# Altium schematic sheet Axis_Channel.SchDoc: Axis Channel
size A3; Organization: ORGANIZATION; Address1: ADDRESS 1; Address2: ADDRESS 2; Address3: ADDRESS 3; Address4: ADDRESS 4; Revision: 1.0; SheetNumber: 4; SheetTotal: 4; ENG_APP_DATE: --/--/--; DSN_APP_DATE: --/--/--; CHK_APP_DATE: --/--/--
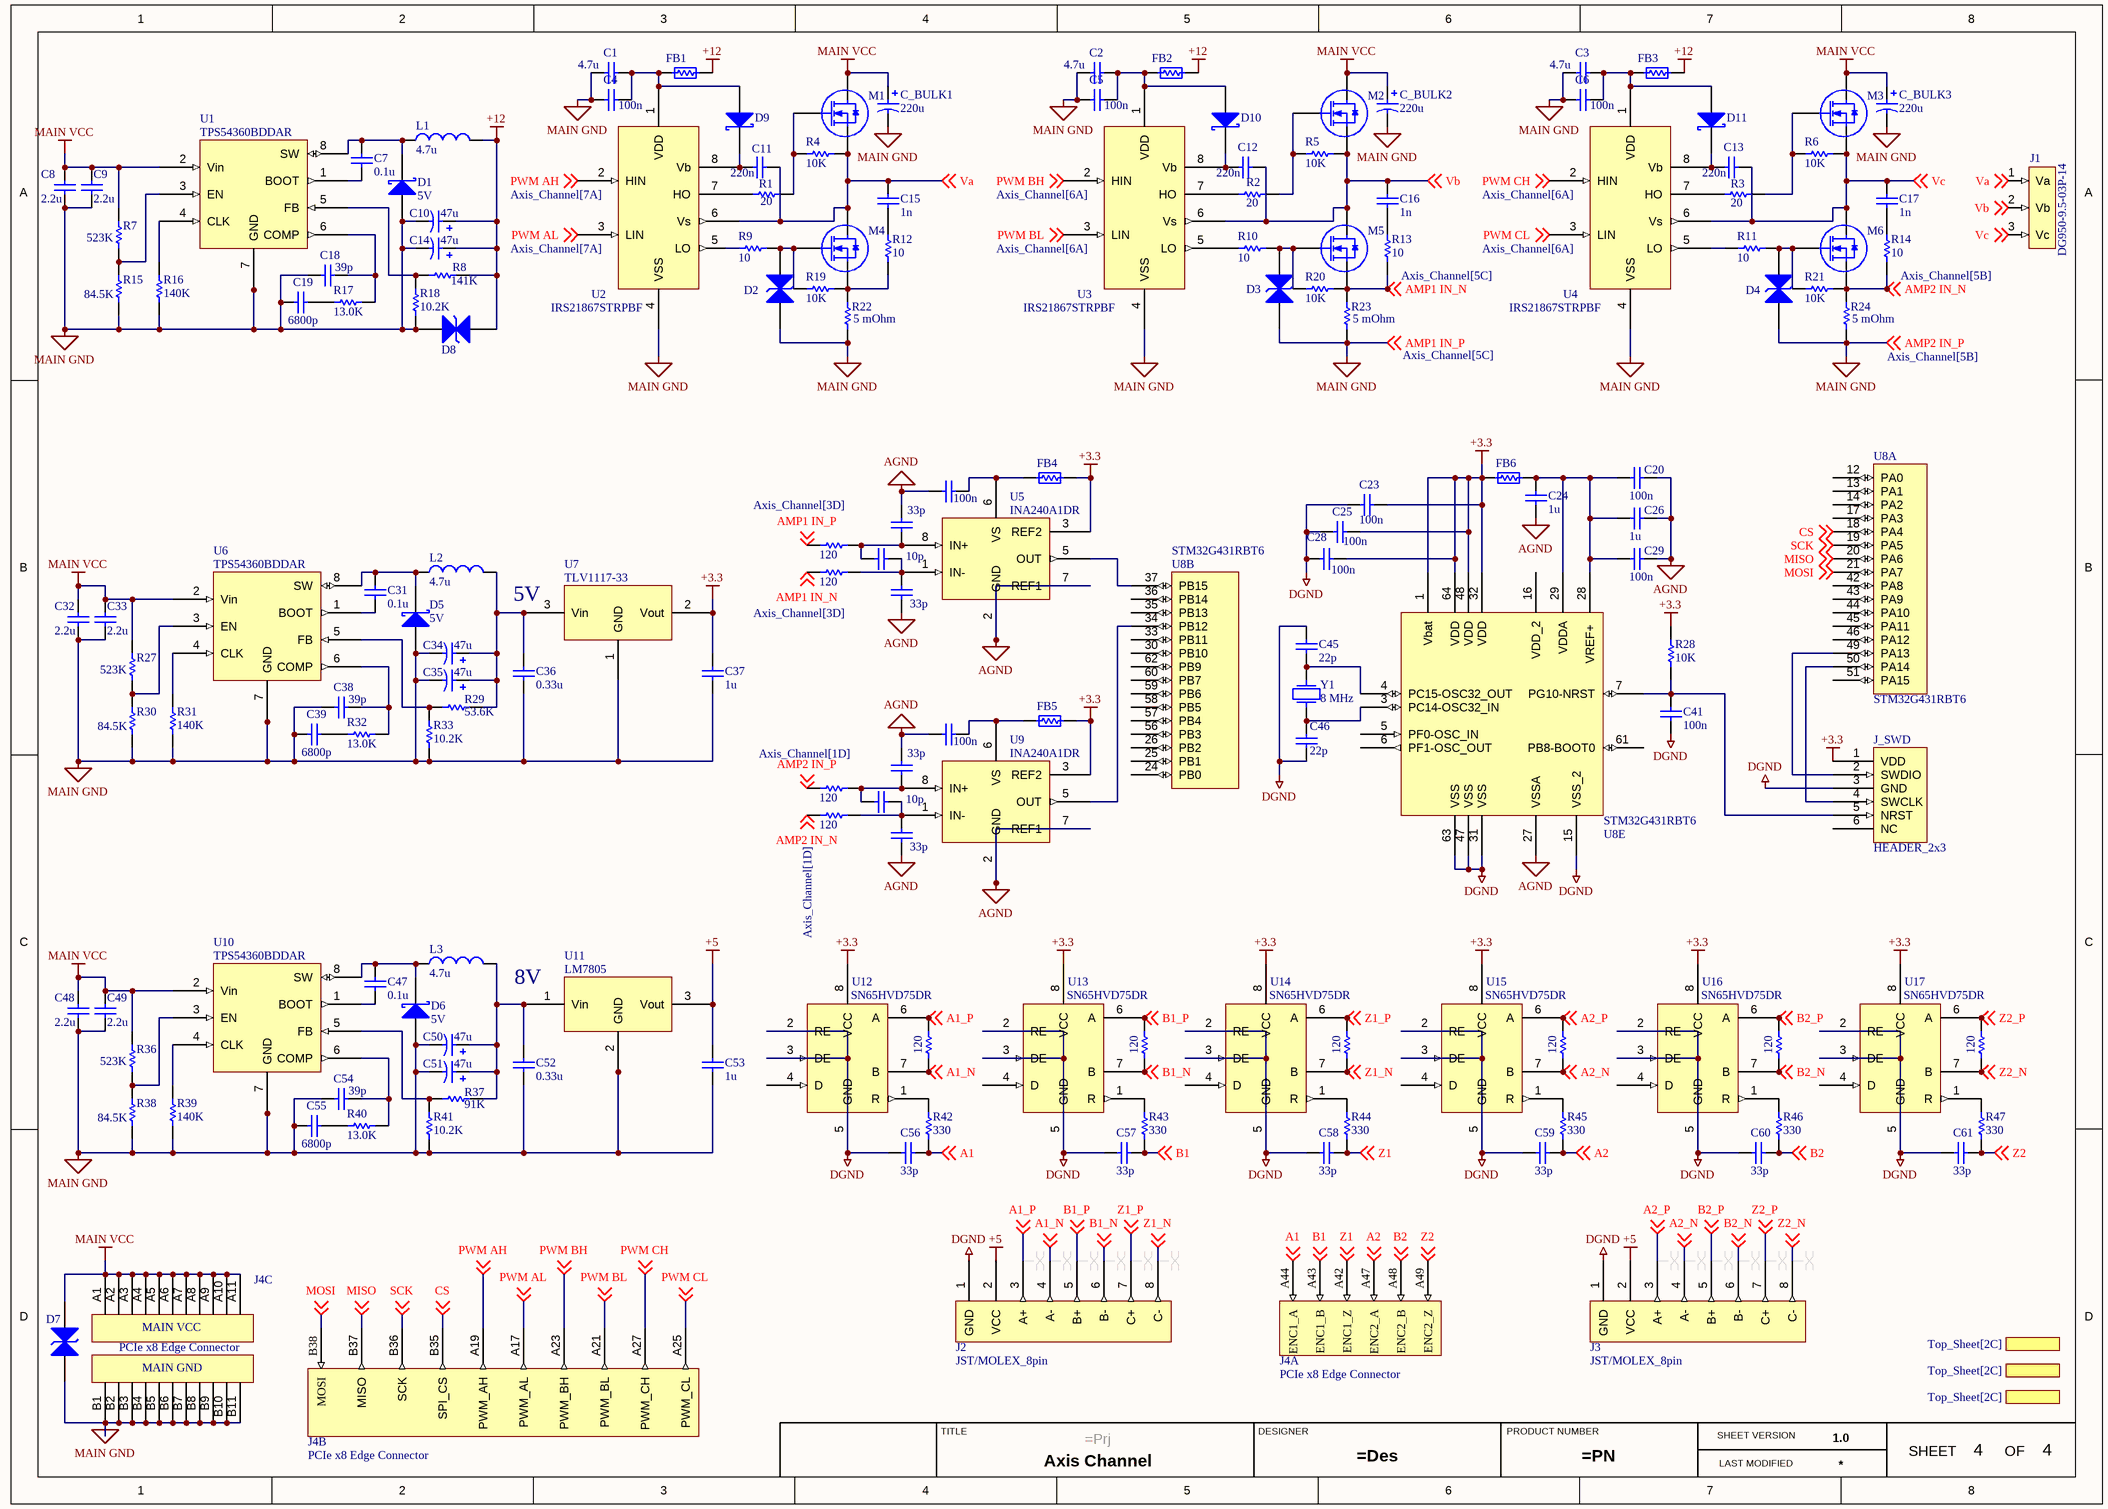
[diagram p0: Axis_Channel.SchDoc]

## Parts
C1  value 4.7u  [1206]  (hidden comment: Capacitor 1206)
C2  value 4.7u  [1206]  (hidden comment: Capacitor 1206)
C3  value 4.7u  [1206]  (hidden comment: Capacitor 1206)
C4  value 100n  [0805]  (hidden comment: Capacitor 0805)
C5  value 100n  [0805]  (hidden comment: Capacitor 0805)
C6  value 100n  [0805]  (hidden comment: Capacitor 0805)
C7  value 0.1u  [0805]  (hidden comment: Alum SMD Cap)
C8  value 2.2u  [1206]  (hidden comment: Alum SMD Cap)
C9  value 2.2u  [1206]  (hidden comment: Capacitor 1206)
C10  value 47u  [ECAP D6.3xL7.7mm]  (hidden comment: Alum SMD Cap)
C11  value 220n  [0805]  (hidden comment: Capacitor 0805)
C12  value 220n  [0805]  (hidden comment: Capacitor 0805)
C13  value 220n  [0805]  (hidden comment: Capacitor 0805)
C14  value 47u  [ECAP D6.3xL7.7mm]  (hidden comment: Alum SMD Cap)
C15  value 1n  [0805]  (hidden comment: Capacitor 0805)
C16  value 1n  [0805]  (hidden comment: Capacitor 0805)
C17  value 1n  [0805]  (hidden comment: Capacitor 0805)
C18  value 39p  [0805]  (hidden comment: Capacitor)
C19  value 6800p  [0805]  (hidden comment: Capacitor 0805)
C20  value 100n  [0805]  (hidden comment: Capacitor 0805)
C21  Parameter 1: 100n  [0805]  (hidden comment: Cap)
C22  Parameter 1: 33p  [0805]  (hidden comment: Cap)
C23  value 100n  [0805]  (hidden comment: Capacitor 0805)
C24  value 1u  [0805]  (hidden comment: Capacitor 0805)
C25  value 100n  [0805]  (hidden comment: Capacitor 0805)
C26  value 1u  [0805]  (hidden comment: Capacitor 0805)
C27  Parameter 1: 10p  [0805]  (hidden comment: Cap)
C28  value 100n  [0805]  (hidden comment: Capacitor 0805)
C29  value 100n  [0805]  (hidden comment: Capacitor 0805)
C30  Parameter 1: 33p  [0805]  (hidden comment: Cap)
C31  value 0.1u  [0805]  (hidden comment: Alum SMD Cap)
C32  value 2.2u  [1206]  (hidden comment: Alum SMD Cap)
C33  value 2.2u  [1206]  (hidden comment: Capacitor 1206)
C34  value 47u  [ECAP D6.3xL7.7mm]  (hidden comment: Alum SMD Cap)
C35  value 47u  [ECAP D6.3xL7.7mm]  (hidden comment: Alum SMD Cap)
C36  value 0.33u  [0805]  (hidden comment: Capacitor 0805)
C37  value 1u  [0805]  (hidden comment: Capacitor 0805)
C38  value 39p  [0805]  (hidden comment: Alum SMD Cap)
C39  value 6800p  [0805]  (hidden comment: Capacitor 0805)
C40  Parameter 1: 100n  [0805]  (hidden comment: Cap)
C41  value 100n  [0805]  (hidden comment: Capacitor 0805)
C42  value 33p  [0805]  (hidden comment: Cap)
C43  Parameter 1: 10p  [0805]  (hidden comment: Cap)
C44  Parameter 1: 33p  [0805]  (hidden comment: Cap)
C45  value 22p  [0805]  (hidden comment: Capacitor 0805)
C46  value 22p  [0805]  (hidden comment: Capacitor 0805)
C47  value 0.1u  [0805]  (hidden comment: Alum SMD Cap)
C48  value 2.2u  [1206]  (hidden comment: Alum SMD Cap)
C49  value 2.2u  [1206]  (hidden comment: Capacitor 1206)
C50  value 47u  [ECAP D6.3xL7.7mm]  (hidden comment: Alum SMD Cap)
C51  value 47u  [ECAP D6.3xL7.7mm]  (hidden comment: Alum SMD Cap)
C52  value 0.33u  [0805]  (hidden comment: Capacitor 0805)
C53  value 1u  [0805]  (hidden comment: Capacitor 0805)
C54  value 39p  [0805]  (hidden comment: Alum SMD Cap)
C55  value 6800p  [0805]  (hidden comment: Capacitor 0805)
C56  value 33p  [0805]  (hidden comment: Capacitor 0805)
C57  value 33p  [0805]  (hidden comment: Capacitor 0805)
C58  value 33p  [0805]  (hidden comment: Capacitor 0805)
C59  value 33p  [0805]  (hidden comment: Capacitor 0805)
C60  value 33p  [0805]  (hidden comment: Capacitor 0805)
C61  value 33p  [0805]  (hidden comment: Capacitor 0805)
C_BULK1  value 220u  [ECAP 12.5x16.5]  (hidden comment: Alum SMD Cap)
C_BULK2  value 220u  [ECAP 12.5x16.5]  (hidden comment: Alum SMD Cap)
C_BULK3  value 220u  [ECAP 12.5x16.5]  (hidden comment: Alum SMD Cap)
D1  value 5V  [SMB]  (hidden comment: Schottky Diod)
D2  Supressor Dual  [SMB]  (value not drawn)
D3  Supressor Dual  [SMB]  (value not drawn)
D4  Supressor Dual  [SMB]  (value not drawn)
D5  value 5V  [SMB]  (hidden comment: Schottky Diod)
D6  value 5V  [SMB]  (hidden comment: Schottky Diod)
D7  Supressor Dual  [SMB]  (value not drawn)
D8  Supressor Dual  [SMB]  (value not drawn)
D9  Schottky Diod  [SMB]  (value not drawn)
D10  Schottky Diod  [SMB]  (value not drawn)
D11  Schottky Diod  [SMB]  (value not drawn)
FB1  Ferrite Bead  [0805]  (value not drawn)
FB2  Ferrite Bead  [0805]  (value not drawn)
FB3  Ferrite Bead  [0805]  (value not drawn)
FB4  Ferrite Bead  [0805]  (value not drawn)
FB5  Ferrite Bead  [0805]  (value not drawn)
FB6  Ferrite Bead  [0805]  (value not drawn)
J1  DG950-9.5-03P-14  [DG950-9.5-03P-14]
J2  JST/MOLEX_8pin  [B8B-EH-A-(LF)(SN)]
J3  JST/MOLEX_8pin  [B8B-EH-A-(LF)(SN)]
J4  PCIe x8 Edge Connector  [MALE_PCI_x8]  (parts A,B,C of 3)
J_SWD  HEADER_2x3  [HEADER_2x3]
L1  value 4.7u  [MWSA0603S-4R7MT]  (hidden comment: Inductor)
L2  value 4.7u  [MWSA0603S-4R7MT]  (hidden comment: Inductor)
L3  value 4.7u  [MWSA0603S-4R7MT]  (hidden comment: Inductor)
M1  NTMFS3D5N08XT1G  [SuperSO8]  (value not drawn)
M2  NTMFS3D5N08XT1G  [SuperSO8]  (value not drawn)
M3  NTMFS3D5N08XT1G  [SuperSO8]  (value not drawn)
M4  NTMFS3D5N08XT1G  [SuperSO8]  (value not drawn)
M5  NTMFS3D5N08XT1G  [SuperSO8]  (value not drawn)
M6  NTMFS3D5N08XT1G  [SuperSO8]  (value not drawn)
R1  value 20  [0805]  (hidden comment: Resistor 0805)
R2  value 20  [0805]  (hidden comment: Resistor 0805)
R3  value 20  [0805]  (hidden comment: Resistor 0805)
R4  value 10K  [0805]  (hidden comment: Resistor 0805)
R5  value 10K  [0805]  (hidden comment: Resistor 0805)
R6  value 10K  [0805]  (hidden comment: Resistor 0805)
R7  value 523K  [0805]  (hidden comment: Resistor 0805)
R8  value 141K  [0805]  (hidden comment: Resistor 0805)
R9  value 10  [0805]  (hidden comment: Resistor 0805)
R10  value 10  [0805]  (hidden comment: Resistor 0805)
R11  value 10  [0805]  (hidden comment: Resistor 0805)
R12  value 10  [0805]  (hidden comment: Resistor 0805)
R13  value 10  [0805]  (hidden comment: Resistor 0805)
R14  value 10  [0805]  (hidden comment: Resistor 0805)
R15  value 84.5K  [0805]  (hidden comment: Resistor 0805)
R16  value 140K  [0805]  (hidden comment: Resistor 0805)
R17  value 13.0K  [0805]  (hidden comment: Resistor 0805)
R18  value 10.2K  [0805]  (hidden comment: Resistor 0805)
R19  value 10K  [0805]  (hidden comment: Resistor 0805)
R20  value 10K  [0805]  (hidden comment: Resistor 0805)
R21  value 10K  [0805]  (hidden comment: Resistor 0805)
R22  value 5 mOhm  [2512]  (hidden comment: Current Shunt)
R23  value 5 mOhm  [2512]  (hidden comment: Current Shunt)
R24  value 5 mOhm  [2512]  (hidden comment: Current Shunt)
R25  value 120  [0805]  (hidden comment: Resistor)
R26  value 120  [0805]  (hidden comment: Resistor)
R27  value 523K  [0805]  (hidden comment: Resistor 0805)
R28  value 10K  [0805]  (hidden comment: Resistor 0805)
R29  value 53.6K  [0805]  (hidden comment: Resistor 0805)
R30  value 84.5K  [0805]  (hidden comment: Resistor 0805)
R31  value 140K  [0805]  (hidden comment: Resistor 0805)
R32  value 13.0K  [0805]  (hidden comment: Resistor 0805)
R33  value 10.2K  [0805]  (hidden comment: Resistor 0805)
R34  value 120  [0805]  (hidden comment: Resistor)
R35  value 120  [0805]  (hidden comment: Resistor)
R36  value 523K  [0805]  (hidden comment: Resistor 0805)
R37  value 91K  [0805]  (hidden comment: Resistor 0805)
R38  value 84.5K  [0805]  (hidden comment: Resistor 0805)
R39  value 140K  [0805]  (hidden comment: Resistor 0805)
R40  value 13.0K  [0805]  (hidden comment: Resistor 0805)
R41  value 10.2K  [0805]  (hidden comment: Resistor 0805)
R42  value 330  [0805]  (hidden comment: Resistor 0805)
R43  value 330  [0805]  (hidden comment: Resistor 0805)
R44  value 330  [0805]  (hidden comment: Resistor 0805)
R45  value 330  [0805]  (hidden comment: Resistor 0805)
R46  value 330  [0805]  (hidden comment: Resistor 0805)
R47  value 330  [0805]  (hidden comment: Resistor 0805)
R48  value 120  [0805]  (hidden comment: Resistor)
R49  value 120  [0805]  (hidden comment: Resistor)
R50  value 120  [0805]  (hidden comment: Resistor)
R51  value 120  [0805]  (hidden comment: Resistor)
R52  value 120  [0805]  (hidden comment: Resistor)
R53  value 120  [0805]  (hidden comment: Resistor)
U1  TPS54360BDDAR  [HSOIC-8-DDA]
U2  IRS21867STRPBF  [SOIC-8]
U3  IRS21867STRPBF  [SOIC-8]
U4  IRS21867STRPBF  [SOIC-8]
U5  INA240A1DR  [SOIC-8]
U6  TPS54360BDDAR  [HSOIC-8-DDA]
U7  TLV1117-33  [SOT-223]
U8  STM32G431RBT6  [LQFP-64_10x10_P0.5]  (parts A,B,E of 5)
U9  INA240A1DR  [SOIC-8]
U10  TPS54360BDDAR  [HSOIC-8-DDA]
U11  LM7805  [TO-263-3]
U12  SN65HVD75DR  [SOIC-8]
U13  SN65HVD75DR  [SOIC-8]
U14  SN65HVD75DR  [SOIC-8]
U15  SN65HVD75DR  [SOIC-8]
U16  SN65HVD75DR  [SOIC-8]
U17  SN65HVD75DR  [SOIC-8]
Y1  value 8 MHz  [hc-49sm]  (hidden comment: OSC)

## Ports
 (harness Power_Blade_Interface, see Top_Sheet[2C]),  (in, see Top_Sheet[2C])

## Nets
+3.3: C23.2 C25.2 C28.2 C37.2 FB4.2 FB5.2 FB6.1 J_SWD.1(VDD) R28.2 U5.3(REF2) U7.2(Vout) U7.4(Vout) U8.1(Vbat) U8.32(VDD) U8.48(VDD) U8.64(VDD) U9.3(REF2) U12.8(VCC) U13.8(VCC) U14.8(VCC) U15.8(VCC) U16.8(VCC) U17.8(VCC)
+5: C53.2 J2.2(VCC) J3.2(VCC) U11.3(Vout)
+12: C10.1 C14.1 D8.2 FB1.2 FB2.2 FB3.2 L1.2 R8.1
AGND: C20.2 C21.2 C22.2 C24.1 C26.2 C29.2 C30.1 C40.2 C42.2 C44.1 U5.2(GND) U5.7(REF1) U8.27(VSSA) U9.2(GND) U9.7(REF1)
DGND: C23.1 C25.1 C28.1 C41.1 C45.1 C46.1 C56.1 C57.1 C58.1 C59.1 C60.1 C61.1 J2.1(GND) J3.1(GND) J_SWD.3(GND) U8.15(VSS_2) U8.31(VSS) U8.47(VSS) U8.63(VSS) U12.2(RE) U12.3(DE) U12.5(GND) U13.2(RE) U13.3(DE) U13.5(GND) U14.2(RE) U14.3(DE) U14.5(GND) U15.2(RE) U15.3(DE) U15.5(GND) U16.2(RE) U16.3(DE) U16.5(GND) U17.2(RE) U17.3(DE) U17.5(GND)
MAIN GND: C1.2 C2.2 C3.2 C4.2 C5.2 C6.2 C8.1 C9.1 C10.2 C14.2 C18.2 C19.2 C32.1 C33.1 C34.2 C35.2 C36.1 C37.1 C38.2 C39.2 C48.1 C49.1 C50.2 C51.2 C52.1 C53.1 C54.2 C55.2 C_BULK1.2 C_BULK2.2 C_BULK3.2 D1.1(A) D2.1 D3.1 D4.1 D5.1(A) D6.1(A) D7.1 D8.1 J4.B1(A19) J4.B2(A20) J4.B3(A21) J4.B4(A22) J4.B5(A23) J4.B6(A24) J4.B7(A25) J4.B8(A26) J4.B9(A27) J4.B10(A28) J4.B11(A29) R15.1 R16.1 R18.1 R22.1 R23.1 R24.1 R25.1 R30.1 R31.1 R33.1 R34.1 R38.1 R39.1 R41.1 U1.7(GND) U1.9(GND) U2.4(VSS) U3.4(VSS) U4.4(VSS) U6.7(GND) U6.9(GND) U7.1(GND) U10.7(GND) U10.9(GND) U11.2(GND) U11.4(GND) ; off-sheet AMP1 IN_P, off-sheet AMP2 IN_P  [also labelled AMP1 IN_P, AMP2 IN_P]
MAIN VCC: C8.2 C9.2 C32.2 C33.2 C48.2 C49.2 C_BULK1.1 C_BULK2.1 C_BULK3.1 D7.2 J4.A1 J4.A2 J4.A3 J4.A4 J4.A5 J4.A6 J4.A7 J4.A8 J4.A9 J4.A10 J4.A11 M1.5(D) M1.6(D) M1.7(D) M1.8(D) M2.5(D) M2.6(D) M2.7(D) M2.8(D) M3.5(D) M3.6(D) M3.7(D) M3.8(D) R7.2 R27.2 R36.2 U1.2(Vin) U6.2(Vin) U10.2(Vin)
A1: C56.2 J4.A44(ENC1_A) R42.2 ; off-sheet A1
A1_N: J2.4(A-) R48.2 U12.7(B) ; off-sheet A1_N
A1_P: J2.3(A+) R48.1 U12.6(A) ; off-sheet A1_P
A2: C59.2 J4.A47(ENC2_A) R45.2 ; off-sheet A2
A2_N: J3.4(A-) R51.2 U15.7(B) ; off-sheet A2_N
A2_P: J3.3(A+) R51.1 U15.6(A) ; off-sheet A2_P
AMP1 IN_N: M5.1(S) M5.2(S) M5.3(S) R13.1 R20.1 R23.2 R26.1 ; off-sheet AMP1 IN_N
AMP2 IN_N: M6.1(S) M6.2(S) M6.3(S) R14.1 R21.1 R24.2 R35.1 ; off-sheet AMP2 IN_N
B1: C57.2 J4.A43(ENC1_B) R43.2 ; off-sheet B1
B1_N: J2.6(B-) R49.2 U13.7(B) ; off-sheet B1_N
B1_P: J2.5(B+) R49.1 U13.6(A) ; off-sheet B1_P
B2: C60.2 J4.A48(ENC2_B) R46.2 ; off-sheet B2
B2_N: J3.6(B-) R52.2 U16.7(B) ; off-sheet B2_N
B2_P: J3.5(B+) R52.1 U16.6(A) ; off-sheet B2_P
CS: J4.B35(SPI_CS) U8.18(PA4) ; off-sheet CS
MISO: J4.B37(MISO) U8.20(PA6) ; off-sheet MISO
MOSI: J4.B38(MOSI) U8.21(PA7) ; off-sheet MOSI
PWM AH: J4.A19(PWM_AH) U2.2(HIN) ; off-sheet PWM AH
PWM AL: J4.A17(PWM_AL) U2.3(LIN) ; off-sheet PWM AL
PWM BH: J4.A23(PWM_BH) U3.2(HIN) ; off-sheet PWM BH
PWM BL: J4.A21(PWM_BL) U3.3(LIN) ; off-sheet PWM BL
PWM CH: J4.A27(PWM_CH) U4.2(HIN) ; off-sheet PWM CH
PWM CL: J4.A25(PWM_CL) U4.3(LIN) ; off-sheet PWM CL
SCK: J4.B36(SCK) U8.19(PA5) ; off-sheet SCK
Va: C11.1 C15.1 J1.1(Va) M1.1(S) M1.2(S) M1.3(S) M4.5(D) M4.6(D) M4.7(D) M4.8(D) R4.1 U2.6(Vs) ; off-sheet Va
Vb: C12.1 C16.1 J1.2(Vb) M2.1(S) M2.2(S) M2.3(S) M5.5(D) M5.6(D) M5.7(D) M5.8(D) R5.1 U3.6(Vs) ; off-sheet Vb
Vc: C13.1 C17.1 J1.3(Vc) M3.1(S) M3.2(S) M3.3(S) M6.5(D) M6.6(D) M6.7(D) M6.8(D) R6.1 U4.6(Vs) ; off-sheet Vc
Z1: C58.2 J4.A42(ENC1_Z) R44.2 ; off-sheet Z1
Z1_N: J2.8(C-) R50.2 U14.7(B) ; off-sheet Z1_N
Z1_P: J2.7(C+) R50.1 U14.6(A) ; off-sheet Z1_P
Z2: C61.2 J4.A49(ENC2_Z) R47.2 ; off-sheet Z2
Z2_N: J3.8(C-) R53.2 U17.7(B) ; off-sheet Z2_N
Z2_P: J3.7(C+) R53.1 U17.6(A) ; off-sheet Z2_P
NetC1_1: C1.1 C4.1 D9.1(A) FB1.1 U2.1(VDD)
NetC2_1: C2.1 C5.1 D10.1(A) FB2.1 U3.1(VDD)
NetC3_1: C3.1 C6.1 D11.1(A) FB3.1 U4.1(VDD)
NetC7_1: C7.1 D1.2(K) L1.1 U1.8(SW)
NetC7_2: C7.2 U1.1(BOOT)
NetC11_2: C11.2 D9.2(K) U2.8(Vb)
NetC12_2: C12.2 D10.2(K) U3.8(Vb)
NetC13_2: C13.2 D11.2(K) U4.8(Vb)
NetC15_2: C15.2 R12.2
NetC16_2: C16.2 R13.2
NetC17_2: C17.2 R14.2
NetC18_1: C18.1 R17.1 U1.6(COMP)
NetC19_1: C19.1 R17.2
NetC20_1: C20.1 C24.2 C26.1 C29.1 FB6.2 U8.28(VREF+) U8.29(VDDA)
NetC21_1: C21.1 FB4.1 U5.6(VS)
NetC22_1: C22.1 C27.2 R25.2 U5.8(IN+)
NetC27_1: C27.1 C30.2 R26.2 U5.1(IN-)
NetC31_1: C31.1 D5.2(K) L2.1 U6.8(SW)
NetC31_2: C31.2 U6.1(BOOT)
NetC34_1: C34.1 C35.1 C36.2 L2.2 R29.1 U7.3(Vin)
NetC38_1: C38.1 R32.1 U6.6(COMP)
NetC39_1: C39.1 R32.2
NetC40_1: C40.1 FB5.1 U9.6(VS)
NetC41_2: C41.2 J_SWD.5(NRST) R28.1 U8.7(PG10-NRST)
NetC42_1: C42.1 C43.2 R34.2 U9.8(IN+)
NetC43_1: C43.1 C44.2 R35.2 U9.1(IN-)
NetC45_2: C45.2 U8.4(PC15-OSC32_OUT) Y1.1
NetC46_2: C46.2 U8.3(PC14-OSC32_IN) Y1.2
NetC47_1: C47.1 D6.2(K) L3.1 U10.8(SW)
NetC47_2: C47.2 U10.1(BOOT)
NetC50_1: C50.1 C51.1 C52.2 L3.2 R37.1 U11.1(Vin)
NetC54_1: C54.1 R40.1 U10.6(COMP)
NetC55_1: C55.1 R40.2
NetD2_2: D2.2 M4.4(G) R9.2 R19.2
NetD3_2: D3.2 M5.4(G) R10.2 R20.2
NetD4_2: D4.2 M6.4(G) R11.2 R21.2
NetJ_SWD_2: J_SWD.2(SWDIO) U8.49(PA13)
NetJ_SWD_4: J_SWD.4(SWCLK) U8.50(PA14)
NetM1_4: M1.4(G) R1.1 R4.2
NetM2_4: M2.4(G) R2.1 R5.2
NetM3_4: M3.4(G) R3.2 R6.2
NetM4_1: M4.1(S) M4.2(S) M4.3(S) R12.1 R19.1 R22.2
NetR1_2: R1.2 U2.7(HO)
NetR2_2: R2.2 U3.7(HO)
NetR3_1: R3.1 U4.7(HO)
NetR7_1: R7.1 R15.2 U1.3(EN)
NetR8_2: R8.2 R18.2 U1.5(FB)
NetR9_1: R9.1 U2.5(LO)
NetR10_1: R10.1 U3.5(LO)
NetR11_1: R11.1 U4.5(LO)
NetR16_2: R16.2 U1.4(CLK)
NetR27_1: R27.1 R30.2 U6.3(EN)
NetR29_2: R29.2 R33.2 U6.5(FB)
NetR31_2: R31.2 U6.4(CLK)
NetR36_1: R36.1 R38.2 U10.3(EN)
NetR37_2: R37.2 R41.2 U10.5(FB)
NetR39_2: R39.2 U10.4(CLK)
NetR42_1: R42.1 U12.1(R)
NetR43_1: R43.1 U13.1(R)
NetR44_1: R44.1 U14.1(R)
NetR45_1: R45.1 U15.1(R)
NetR46_1: R46.1 U16.1(R)
NetR47_1: R47.1 U17.1(R)
NetU5_5: U5.5(OUT) U8.37(PB15)
NetU8_34: U8.34(PB12) U9.5(OUT)

Not connected (* = marked no-connect by the designer): J_SWD 6(NC); U8 5(PF0-OSC_IN) 6(PF1-OSC_OUT) 12(PA0_) 13(PA1) 14(PA2) 16(VDD_2) 17(PA3) 24(PB0) 25(PB1) 26(PB2) 30(PB10) 33(PB11) 35(PB13) 36(PB14) 42(PA8) 43(PA9) 44(PA10) 45(PA11) 46(PA12) 51(PA15) 56(PB3) 57(PB4) 58(PB5) 59(PB6) 60(PB7) 61(PB8-BOOT0) 62(PB9); U12 4(D); U13 4(D); U14 4(D); U15 4(D); U16 4(D); U17 4(D)

## Layout directives
differential pair: A1_N, A2_N, A2_P, B1_N, B1_P, B2_N, B2_P, Z1_N, Z1_P, Z2_N, Z2_P
differential pair; net class *: A1_P

## Notes on the sheet
- 5V
- 8V
- TITLE
- DESIGNER
- PRODUCT NUMBER
- SHEET VERSION
- LAST MODIFIED
- SHEET
- OF
- (in symbol CONN_EDGE_PCIe_x8_98P, part C) MAIN VCC; MAIN GND

## Library data of the parts
C1-C3 C8 C9 C32 C33 C48 C49 = Capacitor 1206: 2.2u-10u
C4-C7 C11-C13 C15-C20 C23-C26 C28 C29 C31 C36-C39 C41 C45-C47 C52-C61 = Capacitor 0805: 0.1u-1u
C10 C14 C34 C35 C50 C51 = RVT1H470M0607 47UF 50V: D6.3xL7.7mm Aluminum Electrolytic Capacitors - SMD-55℃~+105℃ 2800hrs@105℃ 47uF 50V 6.3mm 66mA@120Hz 7.7mm ±20% SMD, ROHS
C21 C22 C27 C30 C40 C42-C44 = Capacitor 0805
C_BULK1-C_BULK3 = 220uF 100V 12.5mm 16.5mm: 100V 12.5mm 16.5mm 220uF ±20% SMD,D12.5xL16.5mm Aluminum Electrolytic Capacitors - SMD ROHS
D2-D4 D7 D8 = Suppressor Dual
D9-D11 = Schottky Diod: Value: 12V
FB1-FB6 = Ferrite Bead: 600 ohm 100Mhz; Value: 1K
J1 = DG950-9.5-03P-14: 3 pin power
J2 J3 = JST/MOLEX_8pin: 8 pin JST
J4 = CONN_EDGE_PCIe_x8_98P
M1-M6 = BSC030N08NS5
R25 R26 R34 R35 R48-R53 = Resistor 0805
U1 U6 U10 = TPS54360BDDAR: Step down DC/DC
U2-U4 = IRS21867STRPBF: -40℃~+150℃@(Tj) 120uA 170ns 170ns 18ns 2 22ns 4A 4A 5V~20V IGBT Low and high Side Under Voltage Protection SOIC-8 Gate Drivers ROHS
U5 U9 = INA240A1DR: Amplifier. A1=20 V/V and +-6.75 Mohm for shunt
U7 = TLV1117-33IDCYR: LDO 3.3V
U8 = STM32G431RBT6: STM32 with ADC
U11 = LM7805: Output Current up to 1A
U12-U17 = SN65HVD75DR: 20 Mbps RS-422/485
Y1 = Crystal